# Altium schematic sheet GPS-SD.SchDoc
size A4; Date: Date; CompanyName: HESSO; Engineer: Name; Address1: Route du Rawyl 47; Address2: 1950 Sion; Address3: Switzerland; SheetNumber: 3; SheetTotal: 2; ProjectName: Project Name
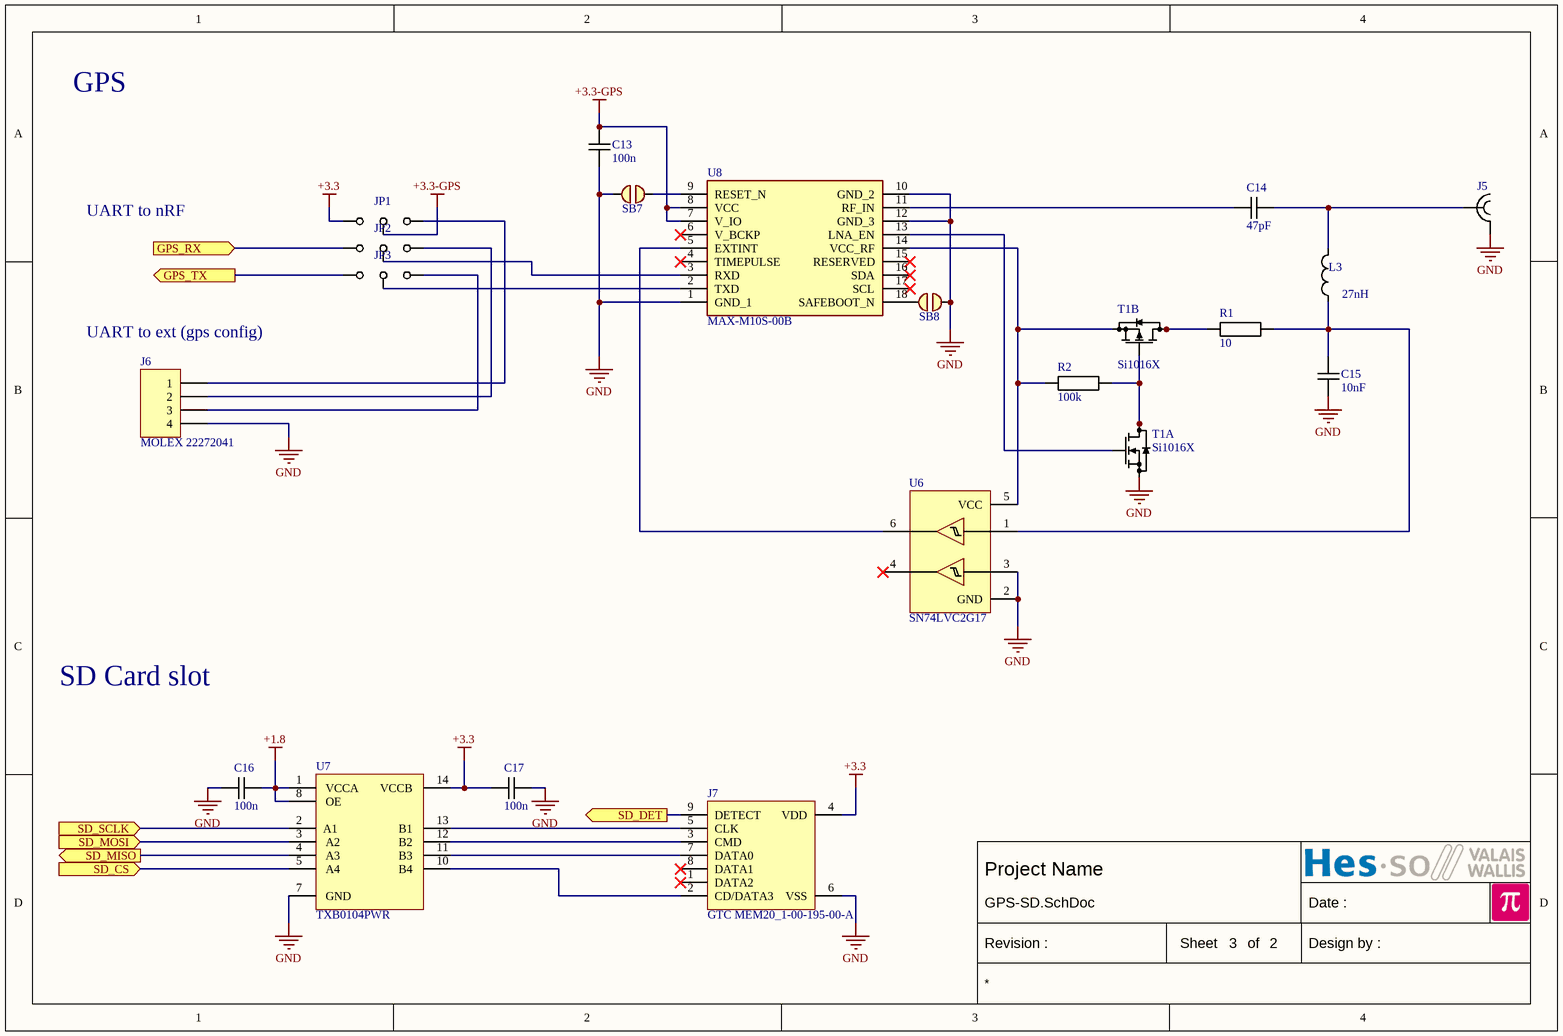
[diagram p0: GPS-SD.SchDoc]

## Parts
C13  100n  [CAPACITOR 1608 REFLOW]
C14  47pF  [CAPACITOR 1608 REFLOW]
C15  10nF  [CAPACITOR 1608 REFLOW]
C16  100n  [CAPACITOR 1608 REFLOW]
C17  100n  [CAPACITOR 1608 REFLOW]
J5  732511150  [SMA EDGE Molex 732511150]  (value not drawn)
J6  MOLEX 22272041  [MOLEX 22272041]
J7  GTC MEM20_1-00-195-00-A  [SD MICRO GCT MEM2051-00-195-00-A]
JP1  {Value}  [JUMPER3 SMD 1608]  (value not drawn)
JP2  {Value}  [JUMPER3 SMD 1608]  (value not drawn)
JP3  {Value}  [JUMPER3 SMD 1608]  (value not drawn)
L3  27nH  [INDUCTOR 1608 REFLOW]
R1  10  [RESISTOR 1608 REFLOW]
R2  100k  [RESISTOR 1608 REFLOW]
SB7  *  [Solder Bridge 1mm Unconnected]  (value not drawn)  (net tie, no BOM)
SB8  *  [Solder Bridge 1mm Unconnected]  (value not drawn)  (net tie, no BOM)
T1  Si1016X  [SOT563F P0.5 C1.6x1.2 H0.6]  (parts A,B of 2)
U6  SN74LVC2G17  [SOT23-6 P0.95 C1.5x3.0 H1.3]
U7  TXB0104PWR  [TSSOP14 P0.65 C4.4x5.0 H1.1]
U8  MAX-M10S-00B  [MAXM10S00B]

## Ports
GPS_RX (in), GPS_TX (out), SD_CS (in), SD_DET (out), SD_MISO (out), SD_MOSI (in), SD_SCLK (in)

## Nets
+1.8: C16.2 U7.1(VCCA) U7.8(OE)
+3.3: C17.2 J7.4(VDD) JP1.1 U7.14(VCCB)
+3.3-GPS: C13.1 JP1.2 U8.7(V_IO) U8.8(VCC)
GND: C13.2 C15.1 C16.1 C17.1 J5.2 J6.4 J7.6(VSS) SB7.1 SB8.2 T1.1(S1) U6.2(GND) U6.3(2A) U7.7(GND) U8.1(GND_1) U8.10(GND_2) U8.12(GND_3)
GPS_RX: JP2.1 ; port GPS_RX
GPS_TX: JP3.1 ; port GPS_TX
SD_CS: U7.5(A4) ; port SD_CS
SD_DET: J7.9(DETECT) ; port SD_DET
SD_MISO: U7.4(A3) ; port SD_MISO
SD_MOSI: U7.3(A2) ; port SD_MOSI
SD_SCLK: U7.2(A1) ; port SD_SCLK
NetC14_1: C14.1 J5.1 L3.2
NetC14_2: C14.2 U8.11(RF_IN)
NetC15_2: C15.2 L3.1 R1.2 U6.1(1A)
NetJ6_1: J6.1 JP1.3
NetJ6_2: J6.2 JP2.3
NetJ6_3: J6.3 JP3.3
NetJ7_2: J7.2(CD/DATA3) U7.10(B4)
NetJ7_3: J7.3(CMD) U7.12(B2)
NetJ7_5: J7.5(CLK) U7.13(B1)
NetJ7_7: J7.7(DATA0) U7.11(B3)
NetJP2_2: JP2.2 U8.3(RXD)
NetJP3_2: JP3.2 U8.2(TXD)
NetR1_1: R1.1 T1.3(D2) T1.5(D2)
NetR2_1: R2.1 T1.4(S2) U6.5(VCC) U8.14(VCC_RF)
NetR2_2: R2.2 T1.5(G2) T1.6(D1) T1.7(D1)
NetSB7_2: SB7.2 U8.9(RESET_N)
NetSB8_1: SB8.1 U8.18(SAFEBOOT_N)
NetT1_2: T1.2(G1) U8.13(LNA_EN)
NetU6_6: U6.6(1Y) U8.5(EXTINT)

Not connected (* = marked no-connect by the designer): J7 1(DATA2)* 8(DATA1)*; U6 4(2Y)*; U8 4(TIMEPULSE)* 6(V_BCKP)* 15(RESERVED)* 16(SDA)* 17(SCL)*

## Notes on the sheet
- GPS
- UART to nRF
- (near J6) UART to ext (gps config)
- SD Card slot
- Date :
- Revision :
- Sheet
- of
- Design by :

## Library data of the parts
C13-C17 = Capacitor: Value: *
J5 = SMA EDGE Molex 732511150: Value: 732511150
J6 = MOLEX 22272041: KK 254 Wire-to-Board Header, Vertical, 4 Circuits
J7 = SD-MICRO GTC MEM20_1-00-195-00-A: SD Card Micro; MF: Global Connector Technology; MP: MEM2051-00-195-00-A; Purchase-URL: https://pricing.snapeda.com/search/part/MEM2051-00-195-00-A/?ref=eda; Price: None; SnapEDA_Link: https://www.snapeda.com/parts/MEM2051-00-195-00-A/Global%20Connector%20Technology/view-part/779220/?ref=snap; Check_prices: https://www.snapeda.com/parts/MEM2051-00-195-00-A/Global%20Connector%20Technology/view-part/779220/?ref=eda; Package: None; Value: GTC MEM20_1-00-195-00-A; Availability: Warning
JP1-JP3 = JUMPER 3 POS: Value: {Value}
L3 = Inductor: Value: *
R1 R2 = Resistor: Value: *
SB7 SB8 = Solderbridge Unconnected: Value: *
T1 = Si1016X: Complementary N- and P-Channel 20 V (D-S) MOSFET; Value: Si1016X
U6 = SN74LVC2G17: Dual Schmitt-Trigger Buffer; Value: SN74LVC2G17
U7 = TXB0104PWR: 4-Bit Bidirectional Voltage-Level Translator With utomatic Direction Sensing and ±15-kV ESD Protection; Value: TXB0104PWR
U8 = MAX-M10S-00B: Standard precision GNSS module; Value: MAX-M10S-00B